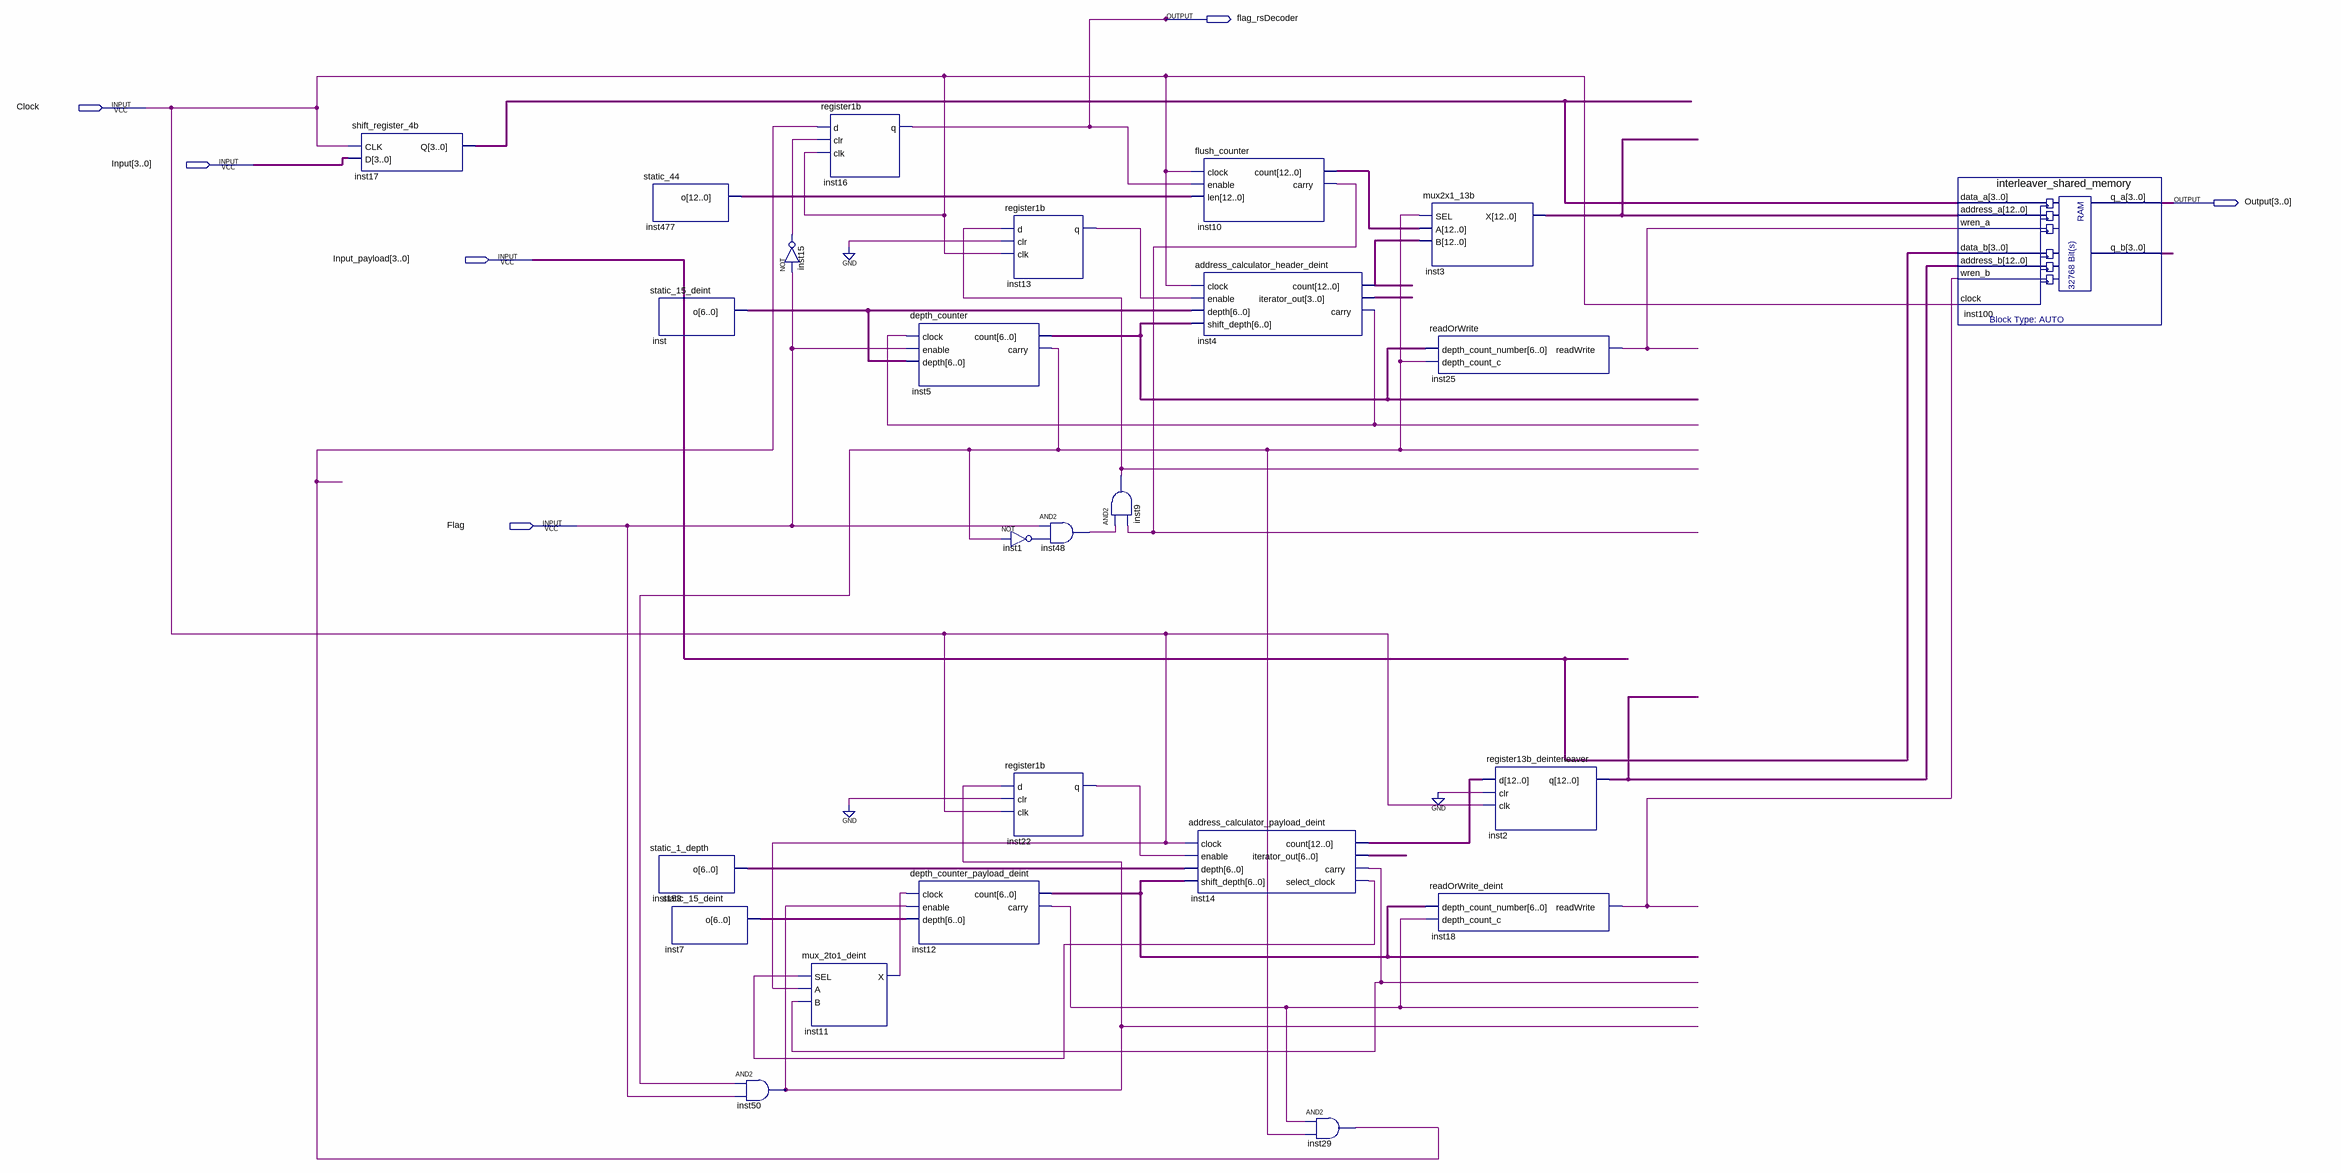
[diagram p0: schematic sheet]
// Quartus schematic deinterleaver_vai.bdf as structural Verilog: 25 symbols, 6 pins
module deinterleaver_vai (
  input  Clock,
  input  [3:0] Input,
  input  [3:0] Input_payload,
  input  Flag,
  output flag_rsDecoder,
  output [3:0] Output
);

  wire inst1_out, inst4_carry, inst5_carry, inst9_out, inst10_carry, inst11_x, inst12_carry, inst13_q,
       inst14_carry, inst14_select_clock, inst15_out, inst18_readwrite, inst22_q, inst25_readwrite,
       inst29_out, inst48_out, inst50_out;
  wire [3:0] inst4_iterator_out, inst17_q, inst100_q_b;
  wire [6:0] inst5_count, inst7_o, inst12_count, inst14_iterator_out, inst153_o, inst_o;
  wire [12:0] inst2_q, inst3_x, inst4_count, inst10_count, inst14_count, inst477_o;

  shift_register_4b inst17 (.CLK(Clock), .D(Input), .Q(inst17_q));
  static_44 inst477 (.o(inst477_o));
  static_15_deint inst (.o(inst_o));
  static_1_depth inst153 (.o(inst153_o));
  static_15_deint inst7 (.o(inst7_o));
  and inst50 (inst50_out, inst5_carry, Flag);
  not inst15 (inst15_out, Flag);
  mux_2to1_deint inst11 (.SEL(inst14_select_clock), .A(Clock), .B(inst14_carry), .X(inst11_x));
  register1b inst16 (.d(inst29_out), .clr(inst15_out), .clk(Clock), .q(flag_rsDecoder));
  depth_counter inst5 (.clock(inst4_carry), .enable(Flag), .depth(inst_o), .count(inst5_count), .carry(inst5_carry));
  depth_counter_payload_deint inst12 (
    .clock(inst11_x), .enable(inst50_out), .depth(inst7_o), .count(inst12_count), .carry(inst12_carry));
  register1b inst13 (.d(inst9_out), .clr(1'b0), .clk(Clock), .q(inst13_q));
  not inst1 (inst1_out, inst5_carry);
  register1b inst22 (.d(inst50_out), .clr(1'b0), .clk(Clock), .q(inst22_q));
  and inst48 (inst48_out, Flag, inst1_out);
  and inst9 (inst9_out, inst48_out, inst10_carry);
  flush_counter inst10 (
    .clock(Clock), .enable(flag_rsDecoder), .len(inst477_o), .count(inst10_count), .carry(inst10_carry));
  address_calculator_header_deint inst4 (
    .clock(Clock), .enable(inst13_q), .depth(inst_o), .shift_depth(inst5_count), .count(inst4_count),
    .iterator_out(inst4_iterator_out), .carry(inst4_carry));
  address_calculator_payload_deint inst14 (
    .clock(Clock), .enable(inst22_q), .depth(inst153_o), .shift_depth(inst12_count), .count(inst14_count),
    .iterator_out(inst14_iterator_out), .carry(inst14_carry), .select_clock(inst14_select_clock));
  and inst29 (inst29_out, inst12_carry, inst5_carry);
  mux2x1_13b inst3 (.SEL(inst5_carry), .A(inst10_count), .B(inst4_count), .X(inst3_x));
  readOrWrite inst25 (.depth_count_number(inst5_count), .depth_count_c(inst5_carry), .readWrite(inst25_readwrite));
  readOrWrite_deint inst18 (
    .depth_count_number(inst12_count), .depth_count_c(inst12_carry), .readWrite(inst18_readwrite));
  register13b_deinterleaver inst2 (.d(inst14_count), .clr(1'b0), .clk(Clock), .q(inst2_q));
  interleaver_shared_memory inst100 (
    .data_a(inst17_q), .address_a(inst3_x), .wren_a(inst25_readwrite), .data_b(Input_payload),
    .address_b(inst2_q), .wren_b(inst18_readwrite), .clock(Clock), .q_a(Output), .q_b(inst100_q_b));
endmodule
